# EAGLE schematic Transmitter_Final(11-13) (EAGLE 8.4.0)
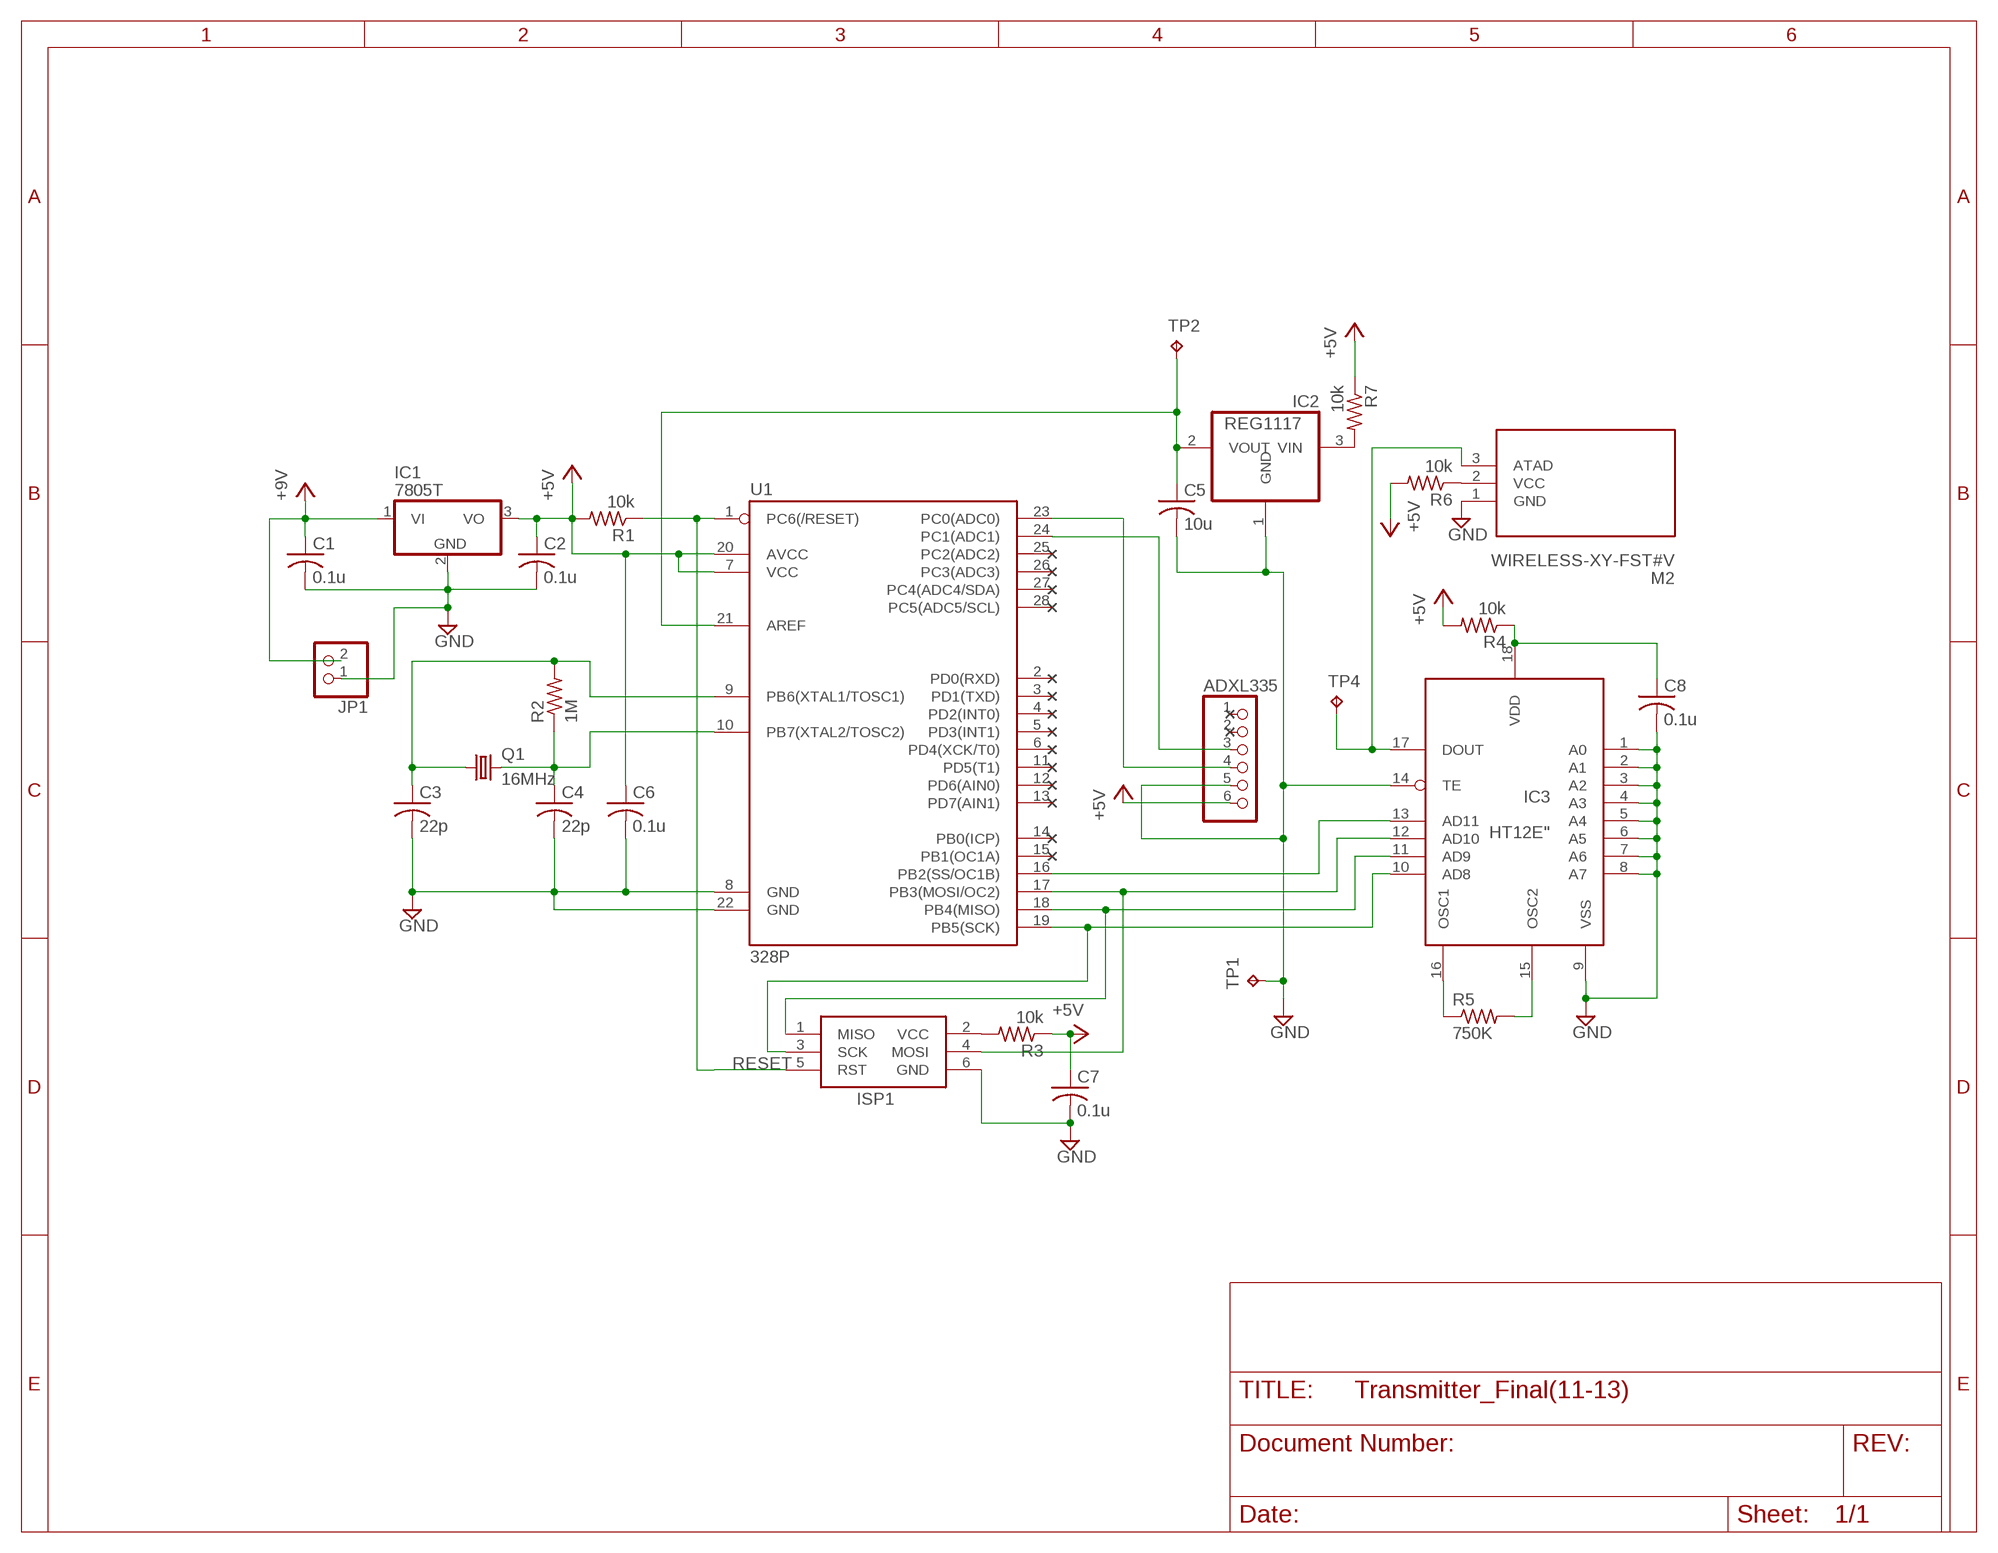
[diagram p0: schematic, sheet 1]

## Parts
ADXL335  PINHD-1X6  [1X06]
C1  0.1u  C-USC0805  [C0805]
C2  0.1u  C-USC0805  [C0805]
C3  22p  C-USC0805  [C0805]
C4  22p  C-USC0805  [C0805]
C5  10u  C-USC0805  [C0805]
C6  0.1u  C-USC0805  [C0805]
C7  0.1u  C-USC0805  [C0805]
C8  0.1u  C-USC0805  [C0805]
IC1  7805T  [TO220H]
IC2  REG1117  [SOT223]
IC3  HT12E"  [18-DIP-A]
ISP1  AVRISP-6  [AVRISP]
JP1  PINHD-1X2  [1X02]
M2  WIRELESS-XY-FST#V  [WIRELESS-XY-FST#V]
Q1  16MHz  CRYTALHC49S  [HC49/S]
R1  10k  R-US_R0805  [R0805]
R2  1M  R-US_R0805  [R0805]
R3  10k  R-US_R0805  [R0805]
R4  10k  R-US_R0805  [R0805]
R5  750K  R-US_R0805  [R0805]
R6  10k  R-US_R0805  [R0805]
R7  10k  R-US_R0805  [R0805]
TP1  TPB1,27  [B1,27]
TP2  TPB1,27  [B1,27]
TP4  TPB1,27  [B1,27]
U1  328P  ATMEGA328P_PDIP  [DIP28]

## Nets
+5V: ADXL335.6 C2.1 C6.1 C7.1 IC1.3(VO) M2.2(VCC) R1.2 R3.1 R4.2 R6.1 R6.2 R7.1 U1.7(VCC) U1.20(AVCC)
AD08: IC3.10(AD8) ISP1.3(SCK) U1.19(PB5(SCK))
AREF: C5.1 IC2.2(VOUT) TP2.TP U1.21(AREF)
GND: ADXL335.5 C1.2 C2.2 C3.2 C4.2 C5.2 C6.2 C7.2 C8.2 IC1.2(GND) IC2.1(GND) IC3.1(A0) IC3.2(A1) IC3.3(A2) IC3.4(A3) IC3.5(A4) IC3.6(A5) IC3.7(A6) IC3.8(A7) IC3.9(VSS) IC3.14(TE) ISP1.6(GND) JP1.1 M2.1(GND) TP1.TP U1.8(GND) U1.22(GND)
N$1: C3.1 Q1.1 R2.2 U1.9(PB6(XTAL1/TOSC1))
N$2: IC3.11(AD9) ISP1.1(MISO) U1.18(PB4(MISO))
N$3: ADXL335.4 U1.23(PC0(ADC0))
N$4: C4.1 Q1.2 R2.1 U1.10(PB7(XTAL2/TOSC2))
N$5: IC3.16(OSC1) R5.1
N$6: IC3.15(OSC2) R5.2
N$7: ISP1.2(VCC) R3.2
N$8: IC3.13(AD11) U1.16(PB2(SS/OC1B))
N$9: IC3.12(AD10) ISP1.4(MOSI) U1.17(PB3(MOSI/OC2))
N$10: IC2.3(VIN) R7.2
N$11: ADXL335.3 U1.24(PC1(ADC1))
N$12: C8.1 IC3.18(VDD) R4.1
N$13: IC3.17(DOUT) M2.3(ATAD) TP4.TP
RESET: ISP1.5(RST) R1.1 U1.1(PC6(/RESET))
VCC: C1.1 IC1.1(VI) JP1.2 ; supply symbol labelled +9V
Unconnected: ADXL335.1 ADXL335.2 U1.2(PD0(RXD)) U1.3(PD1(TXD)) U1.4(PD2(INT0)) U1.5(PD3(INT1)) U1.6(PD4(XCK/T0)) U1.11(PD5(T1)) U1.12(PD6(AIN0)) U1.13(PD7(AIN1)) U1.14(PB0(ICP)) U1.15(PB1(OC1A)) U1.25(PC2(ADC2)) U1.26(PC3(ADC3)) U1.27(PC4(ADC4/SDA)) U1.28(PC5(ADC5/SCL))

## Library data of the parts
ADXL335 = adafruit:PINHD-1X6: PIN HEADER
C1-C8 = adafruit:C-US: CAPACITOR, American symbol
IC1 = linear:78*: Positive VOLTAGE REGULATOR Source: http://cache.national.com/ds/LM/LM78L05.pdf http://www.fairchildsemi.com/ds/LM/LM7805.pdf
IC2 = burr-brown:REG1117: 800mA and 1A Low Dropout (LDO) Positive Regulator 1.8V, 2.5V, 2.85V, 3.3V, 5V, and Adj; MPN: REG1117; OC_FARNELL: 1097566; OC_NEWARK: 14P6981
IC3 = holtek:HT12E: transmitter = encoder ic
ISP1 = adafruit:AVRISP: AVR ISP HEADER Standard 6 pin header for AVR programming
JP1 = pinhead:PINHD-1X2: PIN HEADER
M2 = diy-modules:WIRELESS-XY-FST#V: RF Wireless XY-FST Transmitter vertically mounted Click here to find device on ebay.com <http://www.ebay.com/sch/xd+fst+transmitter> Note: Sold together with receiver.
Q1 = crystal:CRYTAL: CRYSTAL
R1-R7 = adafruit:R-US_: RESISTOR, American symbol
TP1 TP2 TP4 = testpad:TP: Test pad
U1 = SparkFun-IC-Microcontroller:ATMEGA328P_PDIP: Atmel 328P Through hole ATMEGA328P uC used in the Arduino 32kb flash, 1k EEPROM, 2k SRAM Datasheet <http://www.sparkfun.com/datasheets/Components/SMD/ATMega328.pdf> SparkFun Products Storefront component: AVR 28 Pin 20MHz 32K 6A/D - ATMega328P <https://www.sparkfun.com/products/9061> (COM-09061) SparkFun Simon Says - Through-Hole Soldering Kit <https://www.sparkfun.com/products/10547> (KIT-10547) SparkFun Learn to Solder - Simon Says <https://www.sparkfun.com/products/13708> (KIT-13708) SparkFun BigTime Watch Kit <https://www.sparkfun.com/products/11734> (KIT-11734) SparkFun ClockIt <https://www.sparkfun.com/products/10930> (KIT-10930) SparkFun Serial Enabled LCD Kit <https://www.sparkfun.com/products/10097> (LCD-10097) SparkFun Simon Tilts - Through Hole Soldering Kit <https://www.sparkfun.com/products/12634> (KIT-12634) SparkFun Frequency Counter Kit <https://www.sparkfun.com/products/10140> (KIT-10140) FabFM Radio Kit <https://www.sparkfun.com/products/11043> (KIT-11043) SparkFun Binary Blaster Kit <https://www.sparkfun.com/products/12037> (KIT-12037) SparkFun Metro-Gnome <https://www.sparkfun.com/products/9236> (KIT-09236) ATmega328 with Arduino Optiboot (Uno) <https://www.sparkfun.com/products/10524> (DEV-10524); PROD_ID: IC-09136

## Net classes
0 default: width 0.178 mm, drill 0.406 mm, clearance 0.203 mm